# Altium schematic sheet Sheet10.SchDoc: solar-powered-remote-water-level-relay
size 419 x 297 mm; Date: 2026/06/29; Author: forlook88@gmail.com; Revision: 0; SheetNumber: 10; SheetTotal: 11
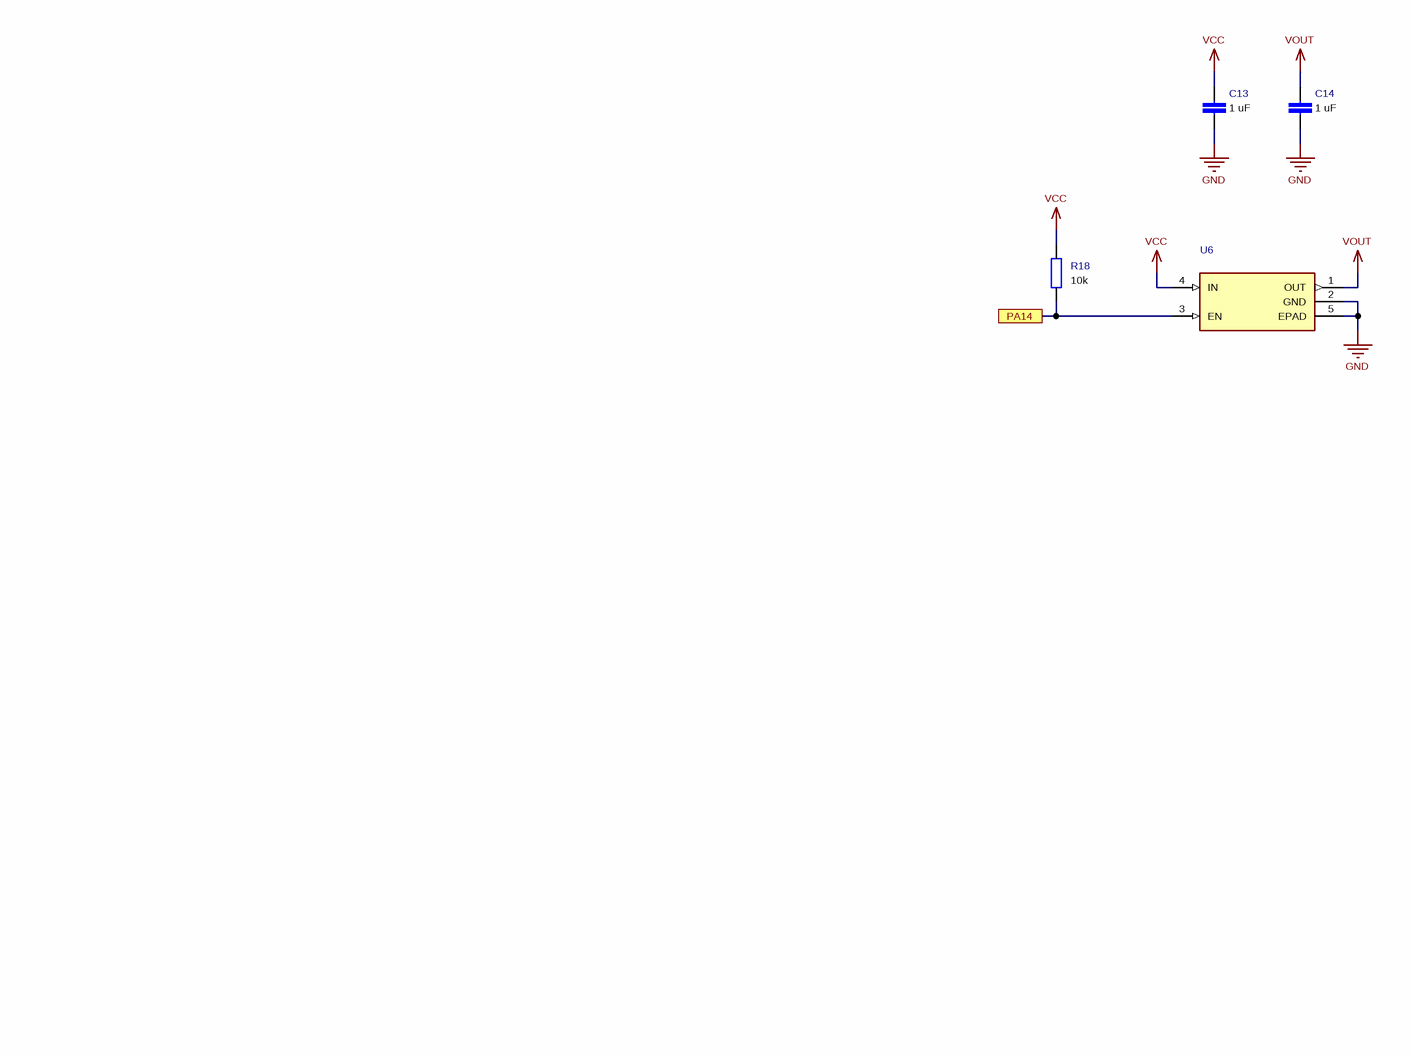
[diagram p0: Sheet10.SchDoc]

## Parts
C13  value 1 uF
C14  value 1 uF
R18  value 10k
U6  (no value)

## Ports
PA14

## Nets
GND: C13.2 C14.2 U6.2(GND) U6.5(EPAD)
VCC: C13.1 R18.2 U6.4(IN)
VOUT: C14.1 U6.1(OUT)
PA14: R18.1 U6.3(EN) ; port PA14

## Notes on the sheet
- Document Name:
- Project Name:
- Sheet Name:
- Sheet Number:
- Author:
- CELUS Design Platform electronic designs are machine-generated drafts and require verification by qualified specialists.
- of
- Revision:
- Date:
- By using these designs, you agree to the CELUS Terms of Use: https://www.celus.io/terms-of-use

## Library data of the parts
C13 C14 = (no symbol name): Manufacturer Part Number: CL05A105KP5NNWC; Manufacturer: Samsung Electro-Mechanics
R18 = (no symbol name): Manufacturer Part Number: ERJ-2GEJ103X; Manufacturer: Panasonic
U6 = (no symbol name): Manufacturer Part Number: NCP114AMX330TBG; Manufacturer: ON Semiconductor